# Altium schematic sheet modFOC-RC-Interface.SchDoc: modFOC-RC-Interface
size A4; Author: Thomas Hofmann; CompanyName: HTL St. Pölten; DrawnBy: Thomas Hofmann; Engineer: Thomas Hofmann; Organization: Altium Limited; Address1: modFOC; Address2: Frenchs Forest; Address3: NSW; Address4: Australia 2086; DocumentNumber: 7; Revision: 2.0; SheetNumber: 7; SheetTotal: 7
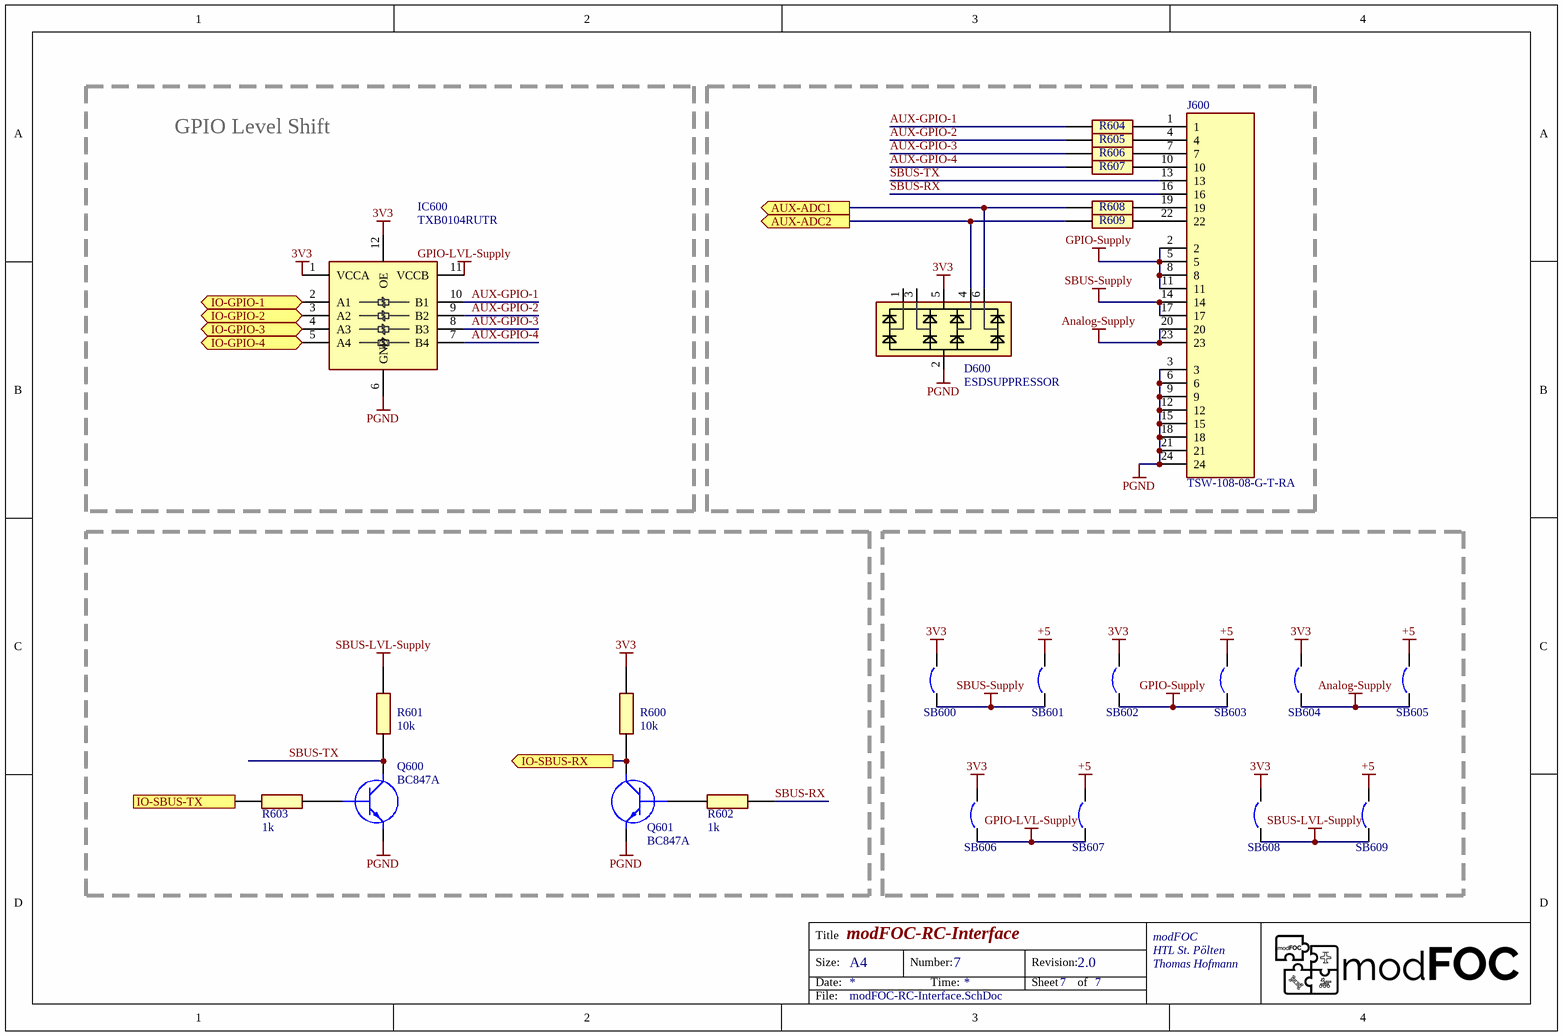
[diagram p0: modFOC-RC-Interface.SchDoc]

## Parts
D600  ESDSUPPRESSOR  [SOT23-6]
IC600  TXB0104RUTR  [TXB0104RUTR]
J600  TSW-108-08-G-T-RA  [HDRRA24W64P254_3X8_2032X254X812P]
Q600  BC847A  [SOT95P230X110-3N]
Q601  BC847A  [SOT95P230X110-3N]
R600  10k  [RESC1608X50N]
R601  10k  [RESC1608X50N]
R602  1k  [RESC1608X50N]
R603  1k  [RESC1608X50N]
R604  100R  [RESC1005X40N]  (value not drawn)
R605  100R  [RESC1005X40N]  (value not drawn)
R606  100R  [RESC1005X40N]  (value not drawn)
R607  100R  [RESC1005X40N]  (value not drawn)
R608  100R  [RESC1005X40N]  (value not drawn)
R609  100R  [RESC1005X40N]  (value not drawn)
SB600  Solder Bridge  [SB0402]  (value not drawn)
SB601  Solder Bridge  [SB0402]  (value not drawn)
SB602  Solder Bridge  [SB0402]  (value not drawn)
SB603  Solder Bridge  [SB0402]  (value not drawn)
SB604  Solder Bridge  [SB0402]  (value not drawn)
SB605  Solder Bridge  [SB0402]  (value not drawn)
SB606  Solder Bridge  [SB0402]  (value not drawn)
SB607  Solder Bridge  [SB0402]  (value not drawn)
SB608  Solder Bridge  [SB0402]  (value not drawn)
SB609  Solder Bridge  [SB0402]  (value not drawn)

## Blocks framed on the sheet
GPIO Level Shift: IC600

## Ports
AUX-ADC1 (out), AUX-ADC2 (out), IO-GPIO-1 (bidir), IO-GPIO-2 (bidir), IO-GPIO-3 (bidir), IO-GPIO-4 (bidir), IO-SBUS-RX (out), IO-SBUS-TX (in)

## Nets
3V3: D600.5(VDD) IC600.1(VCCA) IC600.12(OE) R600.2 SB600.2 SB602.2 SB604.2 SB606.2 SB608.2
+5: SB601.2 SB603.2 SB605.2 SB607.2 SB609.2
Analog-Supply: J600.20 J600.23 SB604.1 SB605.1
GPIO-LVL-Supply: IC600.11(VCCB) SB606.1 SB607.1
GPIO-Supply: J600.2 J600.5 J600.8 J600.11 SB602.1 SB603.1
PGND: D600.2(GND) IC600.6(GND) J600.3 J600.6 J600.9 J600.12 J600.15 J600.18 J600.21 J600.24 Q600.2(E) Q601.2(E)
SBUS-LVL-Supply: R601.2 SB608.1 SB609.1
SBUS-Supply: J600.14 J600.17 SB600.1 SB601.1
AUX-ADC1: D600.6(CH4) R608.1 ; port AUX-ADC1
AUX-ADC2: D600.4(CH3) R609.1 ; port AUX-ADC2
AUX-GPIO-1: IC600.10(B1) R604.1
AUX-GPIO-2: IC600.9(B2) R605.1
AUX-GPIO-3: IC600.8(B3) R606.1
AUX-GPIO-4: IC600.7(B4) R607.1
IO-GPIO-1: IC600.2(A1) ; port IO-GPIO-1
IO-GPIO-2: IC600.3(A2) ; port IO-GPIO-2
IO-GPIO-3: IC600.4(A3) ; port IO-GPIO-3
IO-GPIO-4: IC600.5(A4) ; port IO-GPIO-4
IO-SBUS-RX: Q601.3(C) R600.1 ; port IO-SBUS-RX
IO-SBUS-TX: R603.2 ; port IO-SBUS-TX
SBUS-RX: J600.16 R602.2
SBUS-TX: J600.13 Q600.3(C) R601.1
NetJ600_1: J600.1 R604.2
NetJ600_4: J600.4 R605.2
NetJ600_7: J600.7 R606.2
NetJ600_10: J600.10 R607.2
NetJ600_19: J600.19 R608.2
NetJ600_22: J600.22 R609.2
NetQ600_1: Q600.1(B) R603.1
NetQ601_1: Q601.1(B) R602.1

Not connected (* = marked no-connect by the designer): D600 1(CH1) 3(CH2)

## Notes on the sheet
- Title
- Size:
- Date:
- A4
- Number:
- Time:
- Revision:
- Sheet
- of
- File:

## Library data of the parts
D600 = ESDSUPPRESSOR: TVS Diode Array; Height: 0.6mm
IC600 = TXB0104RUTR: Integrated Circuit; pin to pad: 1>1+13; Manufacturer_Name: Texas Instruments; Datasheet Link: http://www.ti.com/lit/gpn/txb0104; Height: 0.55mm; Manufacturer_Part_Number: TXB0104RUTR; Mouser Part Number: 595-TXB0104RUTR; Mouser Price/Stock: https://www.mouser.co.uk/ProductDetail/Texas-Instruments/TXB0104RUTR?qs=EuM%2FBx4ov4Sspadi61aUCA%3D%3D; Arrow Part Number: TXB0104RUTR; Arrow Price/Stock: https://www.arrow.com/en/products/txb0104rutr/texas-instruments?region=nac
J600 = TSW-108-08-G-T-RA: Connector; Manufacturer_Name: SAMTEC; Datasheet Link: https://componentsearchengine.com/Datasheets/1/TSW-108-08-G-T-RA.pdf; Height: 8.12mm; Manufacturer_Part_Number: TSW-108-08-G-T-RA; Mouser Part Number: 200-TSW10808GTRA; Mouser Price/Stock: https://www.mouser.com/Search/Refine.aspx?Keyword=200-TSW10808GTRA
Q600 Q601 = BC847A,235: Transistor BJT NPN; Manufacturer_Name: Nexperia; Datasheet Link: http://assets.nexperia.com/documents/data-sheet/BC847_SER.pdf; Height: 1.1mm; Manufacturer_Part_Number: BC847A,235; Mouser Part Number: 771-BC847A235; Mouser Price/Stock: https://www.mouser.co.uk/ProductDetail/Nexperia/BC847A235?qs=me8TqzrmIYWeD%252BqPzufrRA%3D%3D; Arrow Part Number: BC847A,235; Arrow Price/Stock: https://www.arrow.com/en/products/bc847a235/nexperia
R600-R603 = R0603: Resistor; Height: 0.55mm
R604-R609 = R0402: Resistor; Height: 0.4mm
SB600-SB609 = Solder Bridge: Internal_Part_Number: MCD-00071; Part_Type: Mechanical; Manufacturer_Part_Number: RC0603JR-070RL; Manufacturer: YAGEO; Provided_By: SUBCO; ECCN_US: n/a; ECCN_EU: n/a; Status: Released; Package: SB0603; ComponentLink1Description: Datasheet; ComponentLink1URL: http://tunmcdsvn.tun.st.com/Component_Datasheet_Library/Trunk/Resistors/Yageo_Resistor_RC0603-series